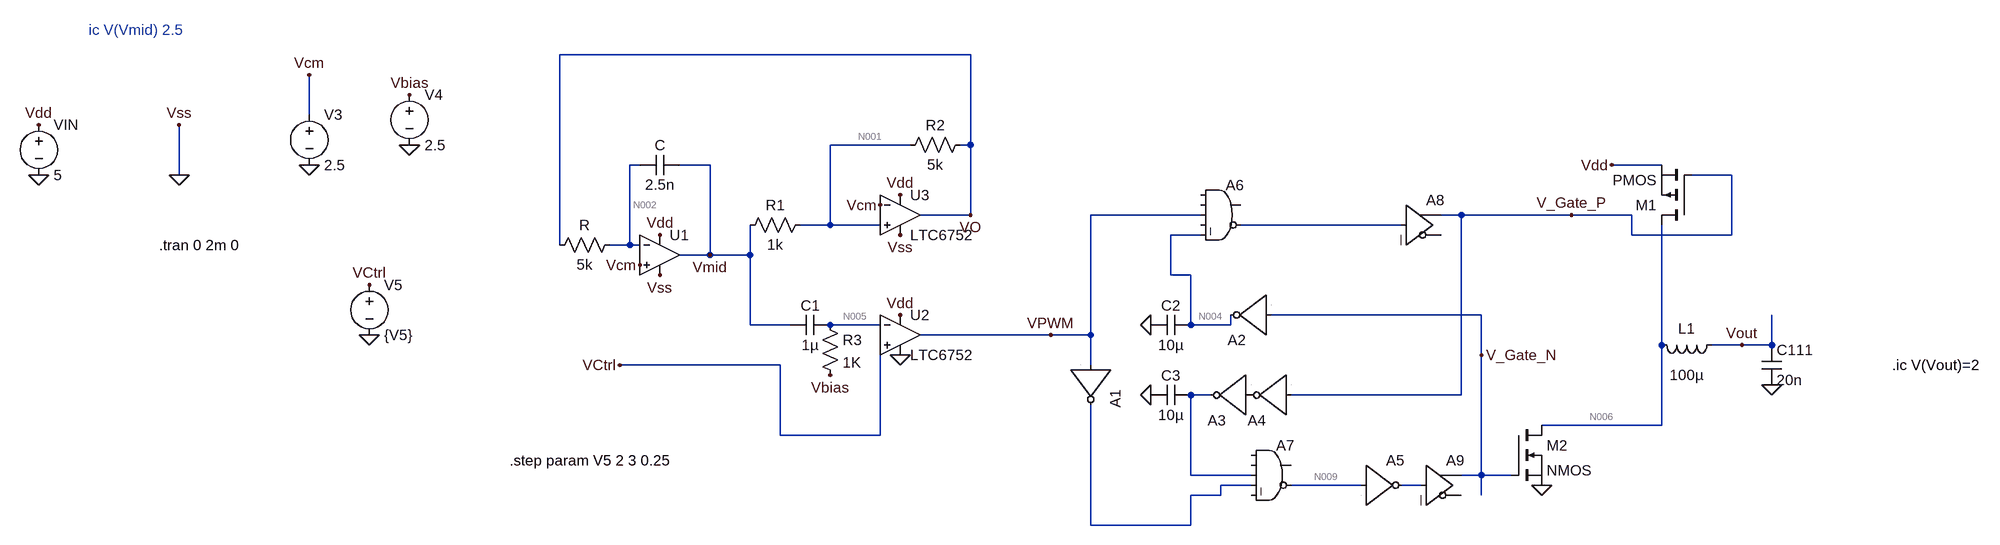
[diagram p0: schematic NOCL_Power_Stage.asc]
NOCL_Power_Stage.asc, the LTspice schematic file:
Version 4
SHEET 1 2520 716
WIRE 624 -128 -32 -128
WIRE -432 -32 -432 -96
WIRE 528 16 400 16
WIRE 624 16 624 -128
WIRE 624 16 608 16
WIRE 96 48 80 48
WIRE 208 48 160 48
WIRE 1728 48 1648 48
WIRE -640 64 -640 -16
WIRE 1840 64 1776 64
WIRE 624 128 624 16
WIRE 624 128 544 128
WIRE 992 128 816 128
WIRE 1408 128 1376 128
WIRE 1584 128 1408 128
WIRE 1680 128 1584 128
WIRE 400 144 400 16
WIRE 400 144 352 144
WIRE 480 144 400 144
WIRE 1312 144 1056 144
WIRE 992 160 944 160
WIRE 1680 160 1680 128
WIRE 1840 160 1840 64
WIRE 1840 160 1680 160
WIRE -32 176 -32 -128
WIRE 80 176 80 48
WIRE 80 176 48 176
WIRE 96 176 80 176
WIRE 208 192 208 48
WIRE 208 192 160 192
WIRE 272 192 272 144
WIRE 272 192 208 192
WIRE 944 224 944 160
WIRE 976 224 944 224
WIRE 1440 288 1104 288
WIRE 272 304 272 192
WIRE 336 304 272 304
WIRE 480 304 400 304
WIRE 976 304 976 224
WIRE 1040 304 1040 288
WIRE 1040 304 976 304
WIRE 752 320 544 320
WIRE 816 320 816 128
WIRE 816 320 752 320
WIRE 1728 336 1728 144
WIRE 1856 336 1808 336
WIRE 1904 336 1904 288
WIRE 1904 336 1856 336
WIRE 1440 352 1440 288
WIRE 320 368 64 368
WIRE 816 368 816 320
WIRE 1008 416 976 416
WIRE 1408 416 1408 128
WIRE 1408 416 1136 416
WIRE 1728 464 1728 336
WIRE 1728 464 1536 464
WIRE 320 480 320 368
WIRE 480 480 480 336
WIRE 480 480 320 480
WIRE 976 544 976 416
WIRE 1072 544 976 544
WIRE 1440 544 1440 352
WIRE 1440 544 1408 544
WIRE 1488 544 1440 544
WIRE 1072 560 1024 560
WIRE 1248 560 1136 560
WIRE 1344 560 1312 560
WIRE 1024 576 1024 560
WIRE 1024 576 976 576
WIRE 1440 576 1440 544
WIRE 816 624 816 432
WIRE 976 624 976 576
WIRE 976 624 816 624
FLAG 128 224 Vss
FLAG 512 160 Vss
FLAG -640 -16 Vss
FLAG 96 208 Vcm
FLAG 480 112 Vcm
FLAG -640 64 0
FLAG -864 64 0
FLAG 624 128 VO
FLAG 208 192 Vmid
FLAG 512 96 Vdd
FLAG 128 160 Vdd
FLAG -864 -16 Vdd
FLAG -432 -96 Vcm
FLAG -432 48 0
FLAG 400 384 Vbias
FLAG -272 -64 Vbias
FLAG -272 16 0
FLAG 512 288 Vdd
FLAG 512 352 0
FLAG 64 368 VCtrl
FLAG -336 240 VCtrl
FLAG -336 320 0
FLAG 752 320 VPWM
FLAG 912 304 0
FLAG 912 416 0
FLAG 1536 560 0
FLAG 1648 48 Vdd
FLAG 1440 352 V_Gate_N
FLAG 1584 128 V_Gate_P
FLAG 1904 400 0
FLAG 1856 336 Vout
DATAFLAG 432 304 ""
DATAFLAG 272 192 ""
SYMBOL Opamps\\UniversalOpamp2 128 192 R0
SYMATTR InstName U1
SYMBOL res 64 160 R90
WINDOW 0 0 56 VBottom 2
WINDOW 3 32 56 VTop 2
SYMATTR InstName R
SYMATTR Value 5k
SYMBOL res 368 128 R90
WINDOW 0 0 56 VBottom 2
WINDOW 3 32 56 VTop 2
SYMATTR InstName R1
SYMATTR Value 1k
SYMBOL res 624 0 R90
WINDOW 0 0 56 VBottom 2
WINDOW 3 32 56 VTop 2
SYMATTR InstName R2
SYMATTR Value 5k
SYMBOL cap 160 32 R90
WINDOW 0 0 32 VBottom 2
WINDOW 3 32 32 VTop 2
SYMATTR InstName C
SYMATTR Value 2.5n
SYMBOL voltage -864 -32 R0
WINDOW 123 0 0 Left 0
WINDOW 39 0 0 Left 0
SYMATTR InstName VIN
SYMATTR Value 5
SYMBOL voltage -432 -48 R0
WINDOW 123 0 0 Left 0
WINDOW 39 0 0 Left 0
SYMATTR InstName V3
SYMATTR Value 2.5
SYMBOL Comparators\\LTC6752 512 64 R0
SYMATTR InstName U3
SYMBOL cap 400 288 R90
WINDOW 0 0 32 VBottom 2
WINDOW 3 32 32 VTop 2
SYMATTR InstName C1
SYMATTR Value 1µ
SYMBOL res 384 288 R0
SYMATTR InstName R3
SYMATTR Value 1K
SYMBOL voltage -272 -80 R0
WINDOW 123 0 0 Left 0
WINDOW 39 0 0 Left 0
SYMATTR InstName V4
SYMATTR Value 2.5
SYMBOL Comparators\\LTC6752 512 256 R0
SYMATTR InstName U2
SYMBOL voltage -336 224 R0
WINDOW 123 0 0 Left 0
WINDOW 39 0 0 Left 0
SYMATTR InstName V5
SYMATTR Value {V5}
SYMBOL cap 976 288 R90
WINDOW 0 0 32 VBottom 2
WINDOW 3 32 32 VTop 2
SYMATTR InstName C2
SYMATTR Value 10µ
SYMBOL cap 976 400 R90
WINDOW 0 0 32 VBottom 2
WINDOW 3 32 32 VTop 2
SYMATTR InstName C3
SYMATTR Value 10µ
SYMBOL Digital\\inv 880 368 R90
WINDOW 3 0 0 Invisible 0
SYMATTR Value Vhigh=5 Vlow=0
SYMATTR InstName A1
SYMATTR Value2 Trise=5n Tfall=5n Td=5n
SYMBOL Digital\\and 1024 64 R0
WINDOW 3 -35 -179 Invisible 2
SYMATTR Value Vhigh=5 Vlow=0
SYMATTR InstName A6
SYMBOL Digital\\and 1104 480 R0
WINDOW 3 -4 207 Invisible 2
SYMATTR Value Vhigh=5 Vlow=0
SYMATTR InstName A7
SYMBOL Digital\\buf 1312 80 R0
WINDOW 3 5 -233 Invisible 2
SYMATTR Value Vhigh=5 Vlow=0
SYMATTR InstName A8
SYMBOL Digital\\buf 1344 496 R0
WINDOW 3 84 202 Invisible 2
SYMATTR Value Vhigh=5 Vlow=0
SYMATTR InstName A9
SYMBOL pmos 1776 144 R180
SYMATTR InstName M1
SYMBOL nmos 1488 464 R0
SYMATTR InstName M2
SYMBOL ind 1824 320 R90
WINDOW 0 5 56 VBottom 2
WINDOW 3 48 56 VTop 2
SYMATTR InstName L1
SYMATTR Value 100µ
SYMBOL cap 1888 336 R0
SYMATTR InstName C111
SYMATTR Value 20n
SYMBOL Digital\\inv 1104 352 R180
WINDOW 3 0 0 Invisible 0
SYMATTR Value Vhigh=5 Vlow=0
SYMATTR InstName A2
SYMATTR Value2 Trise=5n Tfall=5n Td=5n
SYMBOL Digital\\inv 1072 480 R180
WINDOW 3 0 0 Invisible 0
SYMATTR Value Vhigh=5 Vlow=0
SYMATTR InstName A3
SYMATTR Value2 Trise=5n Tfall=5n Td=5n
SYMBOL Digital\\inv 1136 480 R180
WINDOW 3 0 0 Invisible 0
SYMATTR Value Vhigh=5 Vlow=0
SYMATTR InstName A4
SYMATTR Value2 Trise=5n Tfall=5n Td=5n
SYMBOL Digital\\inv 1248 496 R0
WINDOW 3 0 0 Invisible 0
SYMATTR Value Vhigh=5 Vlow=0
SYMATTR InstName A5
SYMATTR Value2 Trise=5n Tfall=5n Td=5n
TEXT -672 176 Left 2 !.tran 0 2m 0
TEXT -784 -168 Left 2 ;ic V(Vmid) 2.5
TEXT 2096 368 Left 2 !.ic V(Vout)=2
TEXT -112 520 Left 2 !.step param V5 2 3 0.25

The netlist it stands for:
* NOCL_Power_Stage.asc
XU1 Vcm N002 Vdd 0 Vmid level.2 Avol=1Meg GBW=10Meg Slew=10Meg ilimit=25m rail=0 Vos=0 phimargin=45 en=0 enk=0 in=0 ink=0 Rin=500Meg  ; pins IN+ IN- V+ V- OUT
R N002 VO 5k
R1 N001 Vmid 1k
R2 VO N001 5k
C Vmid N002 2.5n
VIN Vdd 0 5
V3 Vcm 0 2.5
XU3 N001 Vcm Vdd 0 VO LTC6752  ; pins In+ In- V+ V- OUT
C1 N005 Vmid 1µ
R3 N005 Vbias 1K
V4 Vbias 0 2.5
XU2 VCtrl N005 Vdd 0 VPWM LTC6752  ; pins In+ In- V+ V- OUT
V5 VCtrl 0 {V5}
C2 N004 0 10µ
C3 N007 0 10µ
A1 VPWM 0 0 0 0 N008 0 0 BUF Vhigh=5 Vlow=0 Trise=5n Tfall=5n Td=5n
A6 0 0 VPWM 0 N004 N003 0 0 AND Vhigh=5 Vlow=0
A7 0 0 N007 N008 0 N009 0 0 AND Vhigh=5 Vlow=0
A8 N003 0 0 0 0 0 V_Gate_P 0 BUF Vhigh=5 Vlow=0
A9 N010 0 0 0 0 0 V_Gate_N 0 BUF Vhigh=5 Vlow=0
M1 N006 V_Gate_P Vdd Vdd PMOS
M2 N006 V_Gate_N 0 0 NMOS
L1 Vout N006 100µ
C111 Vout 0 20n
A2 V_Gate_N 0 0 0 0 N004 0 0 BUF Vhigh=5 Vlow=0 Trise=5n Tfall=5n Td=5n
A3 P001 0 0 0 0 N007 0 0 BUF Vhigh=5 Vlow=0 Trise=5n Tfall=5n Td=5n
A4 V_Gate_P 0 0 0 0 P001 0 0 BUF Vhigh=5 Vlow=0 Trise=5n Tfall=5n Td=5n
A5 N009 0 0 0 0 N010 0 0 BUF Vhigh=5 Vlow=0 Trise=5n Tfall=5n Td=5n
.model NMOS NMOS
.model PMOS PMOS
.lib standard.mos
.tran 0 2m 0
* ic V(Vmid) 2.5
.ic V(Vout)=2
.step param V5 2 3 0.25
.lib UniversalOpamps2.sub
.lib LTC7.lib
.backanno
.end

* Results of the author's LTspice run, read from the files saved beside the schematic
* Operating Point, zero values left out:
*   V(vmid) = 2.499 V
*   V(vdd) = 5 V
*   V(n002) = 2.5 V
*   V(vcm) = 2.5 V
*   V(vo) = 2.5 V
*   V(n001) = 2.5 V
*   V(n005) = 2.501 V
*   V(vbias) = 2.5 V
*   V(vctrl) = 2.5 V
*   V(vpwm) = 2.662 V
*   V(n004) = 5 V
*   V(n009) = 5 V
*   V(n006) = 2 V
*   V(vout) = 2 V
*   V(p001) = 5 V
*   Id(M2) = 4.01 pA
*   Ib(M2) = -2.01 pA
*   Is(M2) = -2 pA
*   Id(M1) = -210 µA
*   Ib(M1) = 3.01 pA
*   Is(M1) = 210 µA
*   I(L1) = -210 µA
*   I(R3) = 1.101 µA
*   I(R2) = 60.41 nA
*   I(R1) = 1.185 µA
*   I(V5) = 1.139 µA
*   I(V4) = 1.101 µA
*   I(V3) = 1.115 µA
*   I(Vin) = -24.5 mA
*   Ix(u1:3) = 249.4 µA
*   Ix(u1:4) = -250.6 µA
*   Ix(u1:5) = 1.185 µA
*   Ix(u3:1) = -1.125 µA
*   Ix(u3:2) = -1.115 µA
*   Ix(u3:3) = 12.02 mA
*   Ix(u3:4) = -12.02 mA
*   Ix(u3:5) = -60.41 nA
*   Ix(u2:1) = -1.139 µA
*   Ix(u2:2) = -1.101 µA
*   Ix(u2:3) = 12.03 mA
*   Ix(u2:4) = -12.03 mA